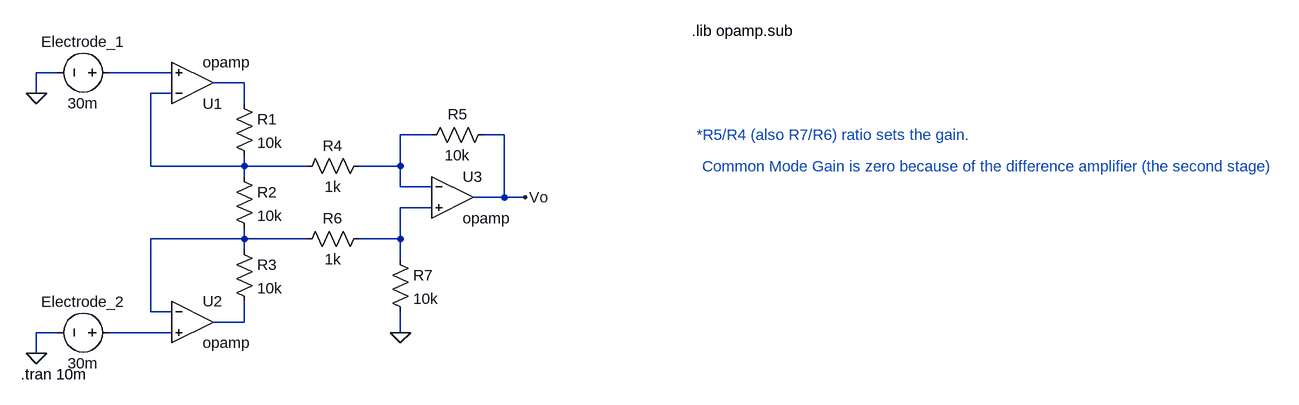
[diagram p0: schematic InstrumentationAmplifier.asc]
InstrumentationAmplifier.asc, the LTspice schematic file:
Version 4
SHEET 1 1668 680
WIRE -272 80 -304 80
WIRE -96 80 -192 80
WIRE 16 96 -32 96
WIRE -304 112 -304 80
WIRE -96 112 -128 112
WIRE 16 128 16 96
WIRE 304 176 256 176
WIRE 416 176 384 176
WIRE -128 224 -128 112
WIRE 16 224 16 208
WIRE 16 224 -128 224
WIRE 112 224 16 224
WIRE 256 224 256 176
WIRE 256 224 192 224
WIRE 16 240 16 224
WIRE 256 256 256 224
WIRE 304 256 256 256
WIRE 416 272 416 176
WIRE 416 272 368 272
WIRE 448 272 416 272
WIRE 304 288 256 288
WIRE 16 336 16 320
WIRE 16 336 -128 336
WIRE 112 336 16 336
WIRE 256 336 256 288
WIRE 256 336 192 336
WIRE 16 352 16 336
WIRE 256 368 256 336
WIRE -128 448 -128 336
WIRE -96 448 -128 448
WIRE 16 464 16 432
WIRE 16 464 -32 464
WIRE -272 480 -304 480
WIRE -96 480 -192 480
WIRE 256 480 256 448
WIRE -304 512 -304 480
FLAG 256 480 0
FLAG -304 112 0
FLAG -304 512 0
FLAG 448 272 Vo
SYMBOL OpAmps\\opamp -64 160 M180
SYMATTR InstName U1
SYMBOL OpAmps\\opamp -64 400 R0
SYMATTR InstName U2
SYMBOL OpAmps\\opamp 336 208 R0
SYMATTR InstName U3
SYMBOL res 0 112 R0
SYMATTR InstName R1
SYMATTR Value 10k
SYMBOL res 0 224 R0
SYMATTR InstName R2
SYMATTR Value 10k
SYMBOL res 0 336 R0
SYMATTR InstName R3
SYMATTR Value 10k
SYMBOL res 208 208 R90
WINDOW 0 0 56 VBottom 2
WINDOW 3 32 56 VTop 2
SYMATTR InstName R4
SYMATTR Value 1k
SYMBOL res 400 160 R90
WINDOW 0 0 56 VBottom 2
WINDOW 3 32 56 VTop 2
SYMATTR InstName R5
SYMATTR Value 10k
SYMBOL res 208 320 R90
WINDOW 0 0 56 VBottom 2
WINDOW 3 32 56 VTop 2
SYMATTR InstName R6
SYMATTR Value 1k
SYMBOL res 240 352 R0
SYMATTR InstName R7
SYMATTR Value 10k
SYMBOL voltage -176 80 R90
WINDOW 0 -32 56 VBottom 2
WINDOW 3 32 56 VTop 2
WINDOW 123 0 0 Left 0
WINDOW 39 0 0 Left 0
SYMATTR InstName Electrode_1
SYMATTR Value 30m
SYMBOL voltage -176 480 R90
WINDOW 0 -32 56 VBottom 2
WINDOW 3 32 56 VTop 2
SYMATTR InstName Electrode_2
SYMATTR Value 30m
TEXT -328 544 Left 2 !.tran 10m
TEXT 704 16 Left 2 !.lib opamp.sub
TEXT 712 176 Left 2 ;*R5/R4 (also R7/R6) ratio sets the gain.
TEXT 720 224 Left 2 ;Common Mode Gain is zero because of the difference amplifier (the second stage)

The netlist it stands for:
* InstrumentationAmplifier.asc
XU1 N003 N001 N002 opamp Aol=100K GBW=10Meg  ; pins invin noninvin out
XU2 N006 N008 N007 opamp Aol=100K GBW=10Meg  ; pins invin noninvin out
XU3 N004 N005 Vo opamp Aol=100K GBW=10Meg  ; pins invin noninvin out
R1 N002 N003 10k
R2 N003 N006 10k
R3 N006 N007 10k
R4 N004 N003 1k
R5 Vo N004 10k
R6 N005 N006 1k
R7 N005 0 10k
V§Electrode_1 N001 0 30m
V§Electrode_2 N008 0 30m
.tran 10m
.lib opamp.sub
* *R5/R4 (also R7/R6) ratio sets the gain.
* Common Mode Gain is zero because of the difference amplifier (the second stage)
.backanno
.end